# Altium schematic sheet MCU.SchDoc
size A4
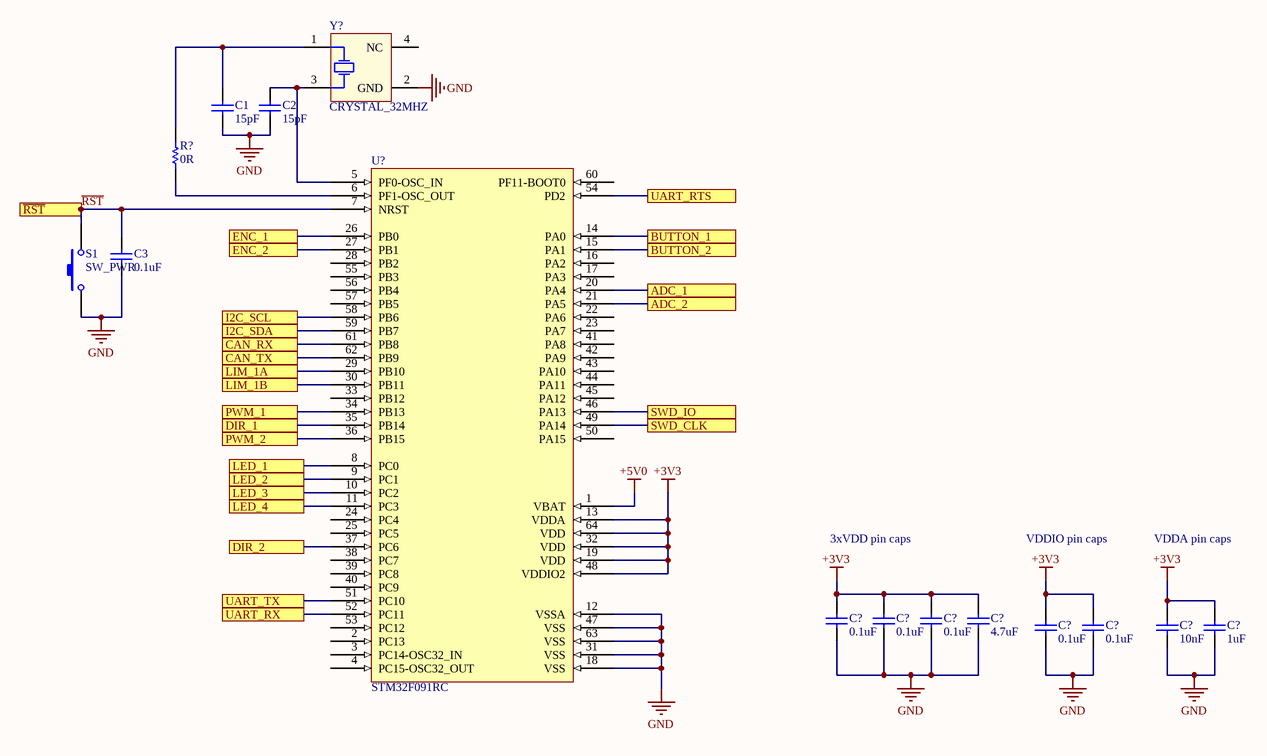
[diagram p0: MCU.SchDoc]

## Parts
(Parts that share a designator on the sheet are numbered #1, #2 ... from top to bottom, then left to right.)
C1  value 15pF  [CAPC0603(1608)55_N]  (hidden comment: CAP_15pF_0603)
C2  value 15pF  [CAPC0603(1608)55_N]  (hidden comment: CAP_15pF_0603)
C3  value 0.1uF  [CAPC0603(1608)55_N]  (hidden comment: CAP_0.1uF_16V_0603)
C?#1  value 0.1uF  [CAPC0603(1608)55_N]  (hidden comment: CAP_0.1uF_16V_0603)
C?#2  value 0.1uF  [CAPC0603(1608)55_N]  (hidden comment: CAP_0.1uF_16V_0603)
C?#3  value 0.1uF  [CAPC0603(1608)55_N]  (hidden comment: CAP_0.1uF_16V_0603)
C?#4  value 4.7uF  [CAPC0603(1608)55_N]  (hidden comment: CAP_4.7uF_0603)
C?#5  value 0.1uF  [CAPC0603(1608)55_N]  (hidden comment: CAP_0.1uF_16V_0603)
C?#6  value 0.1uF  [CAPC0603(1608)55_N]  (hidden comment: CAP_0.1uF_16V_0603)
C?#7  value 10nF  [CAPC0603(1608)55_N]  (hidden comment: CAP_10nF_0603)
C?#8  value 1uF  [CAPC0603(1608)55_N]  (hidden comment: CAP_1uF_16V_0603)
R?  value 0R  [RESC0201(0603)_N]  (hidden comment: RES_0R_0603)
S1  SW_PWR  [SPST-2]
U?  STM32F091RC  [STM-LQFP64_M]
Y?  CRYSTAL_32MHZ  [AVX-CX2520DB32000D0GEJZ1-4_V]

## Ports
ADC_1, ADC_2, BUTTON_1, BUTTON_2, CAN_RX, CAN_TX, DIR_1, DIR_2, ENC_1, ENC_2, I2C_SCL, I2C_SDA, LED_1, LED_2, LED_3, LED_4, LIM_1A, LIM_1B, PWM_1, PWM_2, SWD_CLK, SWD_IO, UART_RTS, UART_RX, UART_TX, ~{RST} (in)

## Nets
+3V3: C?#1.2 C?#2.2 C?#3.2 C?#4.2 C?#5.2 C?#6.2 C?#7.2 C?#8.2 U?.13(VDDA) U?.19(VDD) U?.32(VDD) U?.48(VDDIO2) U?.64(VDD)
+5V0: U?.1(VBAT)
GND: C1.1 C2.1 C3.1 C?#1.1 C?#2.1 C?#3.1 C?#4.1 C?#5.1 C?#6.1 C?#7.1 C?#8.1 S1.1 U?.12(VSSA) U?.18(VSS) U?.31(VSS) U?.47(VSS) U?.63(VSS) Y?.2(GND)
ADC_1: U?.20(PA4) ; port ADC_1
ADC_2: U?.21(PA5) ; port ADC_2
BUTTON_1: U?.14(PA0) ; port BUTTON_1
BUTTON_2: U?.15(PA1) ; port BUTTON_2
CAN_RX: U?.61(PB8) ; port CAN_RX
CAN_TX: U?.62(PB9) ; port CAN_TX
DIR_1: U?.35(PB14) ; port DIR_1
DIR_2: U?.37(PC6) ; port DIR_2
ENC_1: U?.26(PB0) ; port ENC_1
ENC_2: U?.27(PB1) ; port ENC_2
I2C_SCL: U?.58(PB6) ; port I2C_SCL
I2C_SDA: U?.59(PB7) ; port I2C_SDA
LED_1: U?.8(PC0) ; port LED_1
LED_2: U?.9(PC1) ; port LED_2
LED_3: U?.10(PC2) ; port LED_3
LED_4: U?.11(PC3) ; port LED_4
LIM_1A: U?.29(PB10) ; port LIM_1A
LIM_1B: U?.30(PB11) ; port LIM_1B
PWM_1: U?.34(PB13) ; port PWM_1
PWM_2: U?.36(PB15) ; port PWM_2
~{RST}: C3.2 S1.2 U?.7(NRST) ; port ~{RST}
SWD_CLK: U?.49(PA14) ; port SWD_CLK
SWD_IO: U?.46(PA13) ; port SWD_IO
UART_RTS: U?.54(PD2) ; port UART_RTS
UART_RX: U?.52(PC11) ; port UART_RX
UART_TX: U?.51(PC10) ; port UART_TX
NetC1_2: C1.2 R?.2 Y?.1(HOT)
NetC2_2: C2.2 U?.5(PF0-OSC_IN) Y?.3(HOT)
NetR?_1: R?.1 U?.6(PF1-OSC_OUT)

Not connected (* = marked no-connect by the designer): U? 2(PC13) 3(PC14-OSC32_IN) 4(PC15-OSC32_OUT) 16(PA2) 17(PA3) 22(PA6) 23(PA7) 24(PC4) 25(PC5) 28(PB2) 33(PB12) 38(PC7) 39(PC8) 40(PC9) 41(PA8) 42(PA9) 43(PA10) 44(PA11) 45(PA12) 50(PA15) 53(PC12) 55(PB3) 56(PB4) 57(PB5) 60(PF11-BOOT0); Y? 4(NC)

## Notes on the sheet
- 3xVDD pin caps
- VDDIO pin caps
- VDDA pin caps

## Library data of the parts
C1 C2 = CAP_15pF_0603: CAP CER 15PF 250V NPO 0603; Part Number: AC0603JRNPOYBN150; Manufacturer: Yageo; Temperature Coefficient: NP0; Dimensions: 0.063" L x 0.031" W (1.60mm x 0.80mm); Package: 0603 (1608 Metric); Voltage Rating: 250v
C3 C?#1-C?#3 C?#5 C?#6 = CAP_0.1uF_16V_0603: CAP CER 0.1UF 16V X7R 0603; Part Number: CC0603KRX7R7BB104; Manufacturer: Yageo; Dimensions: 0.063" L x 0.031" W (1.60mm x 0.80mm); Package: 0603 (1608 Metric); Temperature Coefficient: X7R; Voltage Rating: 16V
C?#4 = CAP_4.7uF_0603: CAP CER 4.7UF 6.3V X5R 0603; Part Number: CC0603KRX5R5BB475; Manufacturer: Yageo; Dimensions: 0.063" L x 0.031" W (1.60mm x 0.80mm); Package: 0603 (1608 Metric); Temperature Coefficient: X5R; Voltage Rating: 6.3V
C?#7 = CAP_10nF_0603: CAP CER 10000PF 16V X7R 0603; Part Number: CC0603KRX7R7BB103; Manufacturer: Yageo; Dimensions: 0.063" L x 0.031" W (1.60mm x 0.80mm); Package: 0603 (1608 Metric); Temperature Coefficient: X7R; Voltage Rating: 16V
C?#8 = CAP_1uF_16V_0603: CAP CER 1UF 16V Y5V 0603; Part Number: CC0603ZRY5V7BB105; Manufacturer: Yageo; Dimensions: 0.063" L x 0.031" W (1.60mm x 0.80mm); Package: 0603 (1608 Metric); Temperature Coefficient: Y5V; Voltage Rating: 16V
R? = RES_0R_0603: RES SMD 0 OHM JUMPER 1/10W 0603; Manufacturer: Yageo; Part Number (MPN): RC0603JR-070RL; Package: 0603 (1608 Metric); Dimensions: 0.063" L x 0.031" W (1.60mm x 0.80mm)
S1 = SW_PWR: Switch; Published: 24-Mar-1999; LatestRevisionDate: 17-Jul-2002; LatestRevisionNote: Re-released for DXP Platform.; PackageReference: SPST-2; Publisher: Altium Limited; PackageDescription: Switch; 2 Leads
U? = STM32F091RC: Manufacturer: STMicroelectronics; Part Number: STM32F091RC; Package: 64-LQFP; ComponentLink1Description: Datasheet; ComponentLink1URL: https://www.st.com/content/ccc/resource/technical/document/datasheet/95/3c/2e/5b/21/09/45/a6/DM00115237.pdf/files/DM00115237.pdf/jcr:content/translations/en.DM00115237.pdf#%5B%7B%22num%22%3A96%2C%22gen%22%3A0%7D%2C%7B%22name%22%3A%22XYZ%22%7D%2C67%2C755%2Cnull%5D
Y? = CRYSTAL_32MHZ: CRYSTAL 32MHZ 8PF SMD; Part Number: CX2520DB32000D0GPSC1; Manufacturer: Kyocera International Inc. Electronic Components; Package: 4-SMD, No Lead; Dimensions: 0.098" L x 0.079" W (2.50mm x 2.00mm)